# Altium schematic sheet MCU_SCH.SchDoc
size B; SheetNumber: 3; SheetTotal: 9; SPICEModelCacheGSGSOODR: <root> / <DocumentId>GSGSOODR</DocumentId> / <CacheFrame Number="0"> / <Model Name="lmk107b7225_a-tr" Kind="CKT"> / <Text>* LMK107B7225_A-TR     SPICE MODEL  ( General Type ) / *-------------------------------------------------------------------------------------------------------- / * Model Generated by TAIYO YUDEN Corporation (http://www.ty-top.com) / * Version 1.0 / * TAIYO YUDEN Control No. 170508_100817 / * Copyright(c) 2012 TAIYO YUDEN CO.,LTD. All Rights Reserved. / *-------------------------------------------------------------------------------------------------------- / * / * Products Name : Multilayer Ceramic Capacitors / * / * Characteristics : / *     Capacitance : 2.2 uF , Rated Voltage : 10V , TCC : X7R / *     Case Size : 1.6 x 0.8 / 0.063 x 0.031 [mm/inch] , Thickness : 0.8 / 0.031 [mm/inch] / *     (Conditions: Temperature = 25 degC , DC Bias Current/Voltage = 0A / 0V) / * / * Frequency Range : 40Hz - 3GHz / * / * External Node Assignments : / * / *  1  o---| |---o  2 / * / *-------------------------------------------------------------------------------------------------------- / .SubCkt LMK107B7225_A-TR 1 2 / **************************** / C0 1 110 1.6448u / Cm 1 101 0.35593u / C1 101 102 0.58122u / Rc1 101 102 1.399k / C2 102 103 0.16803u / Rc2 102 103 145.45 / C3 103 110 0.093029u / Rc3 103 110 10.174 / C2m 1 301 0.50048u / C21 301 302 1.5848u / Rc21 301 302 3.55k / C22 302 303 1.5193u / Rc22 302 303 3.3641k / C23 303 304 2.179u / Rc23 303 304 2.1549k / C24 304 305 0.86851u / Rc24 304 305 215.54 / C25 305 306 0.87682u / Rc25 305 306 159.72 / C26 306 307 1.7101u / Rc26 306 307 4.7719 / C27 307 308 0.6214u / Rc27 307 308 12.394 / C28 308 309 0.643u / Rc28 308 309 10.101 / C29 309 110 5422p / Rc29 309 110 0.99109 / Rp0 1 110 45.4545454545455Meg / L0 110 120 0.23321n / Lm 120 130 0.16586n / L1 120 121 0.12676n / RL1 121 130 86.335m / L2 120 122 0.61599n / RL2 122 130 0.38949 / L3 120 123 0.67084n / RL3 123 130 0.43251 / CR 120 124 0.12415u / LR 124 125 0.46265n / RR 125 130 72.926m / CL 130 140 1.3749p / LL 130 140 0.23217n / RL 130 140 32.536 / Rs 140 2 6.8187m / **************************** / .ends LMK107B7225_A-TR</Text> / </Model> / </CacheFrame> / </root>
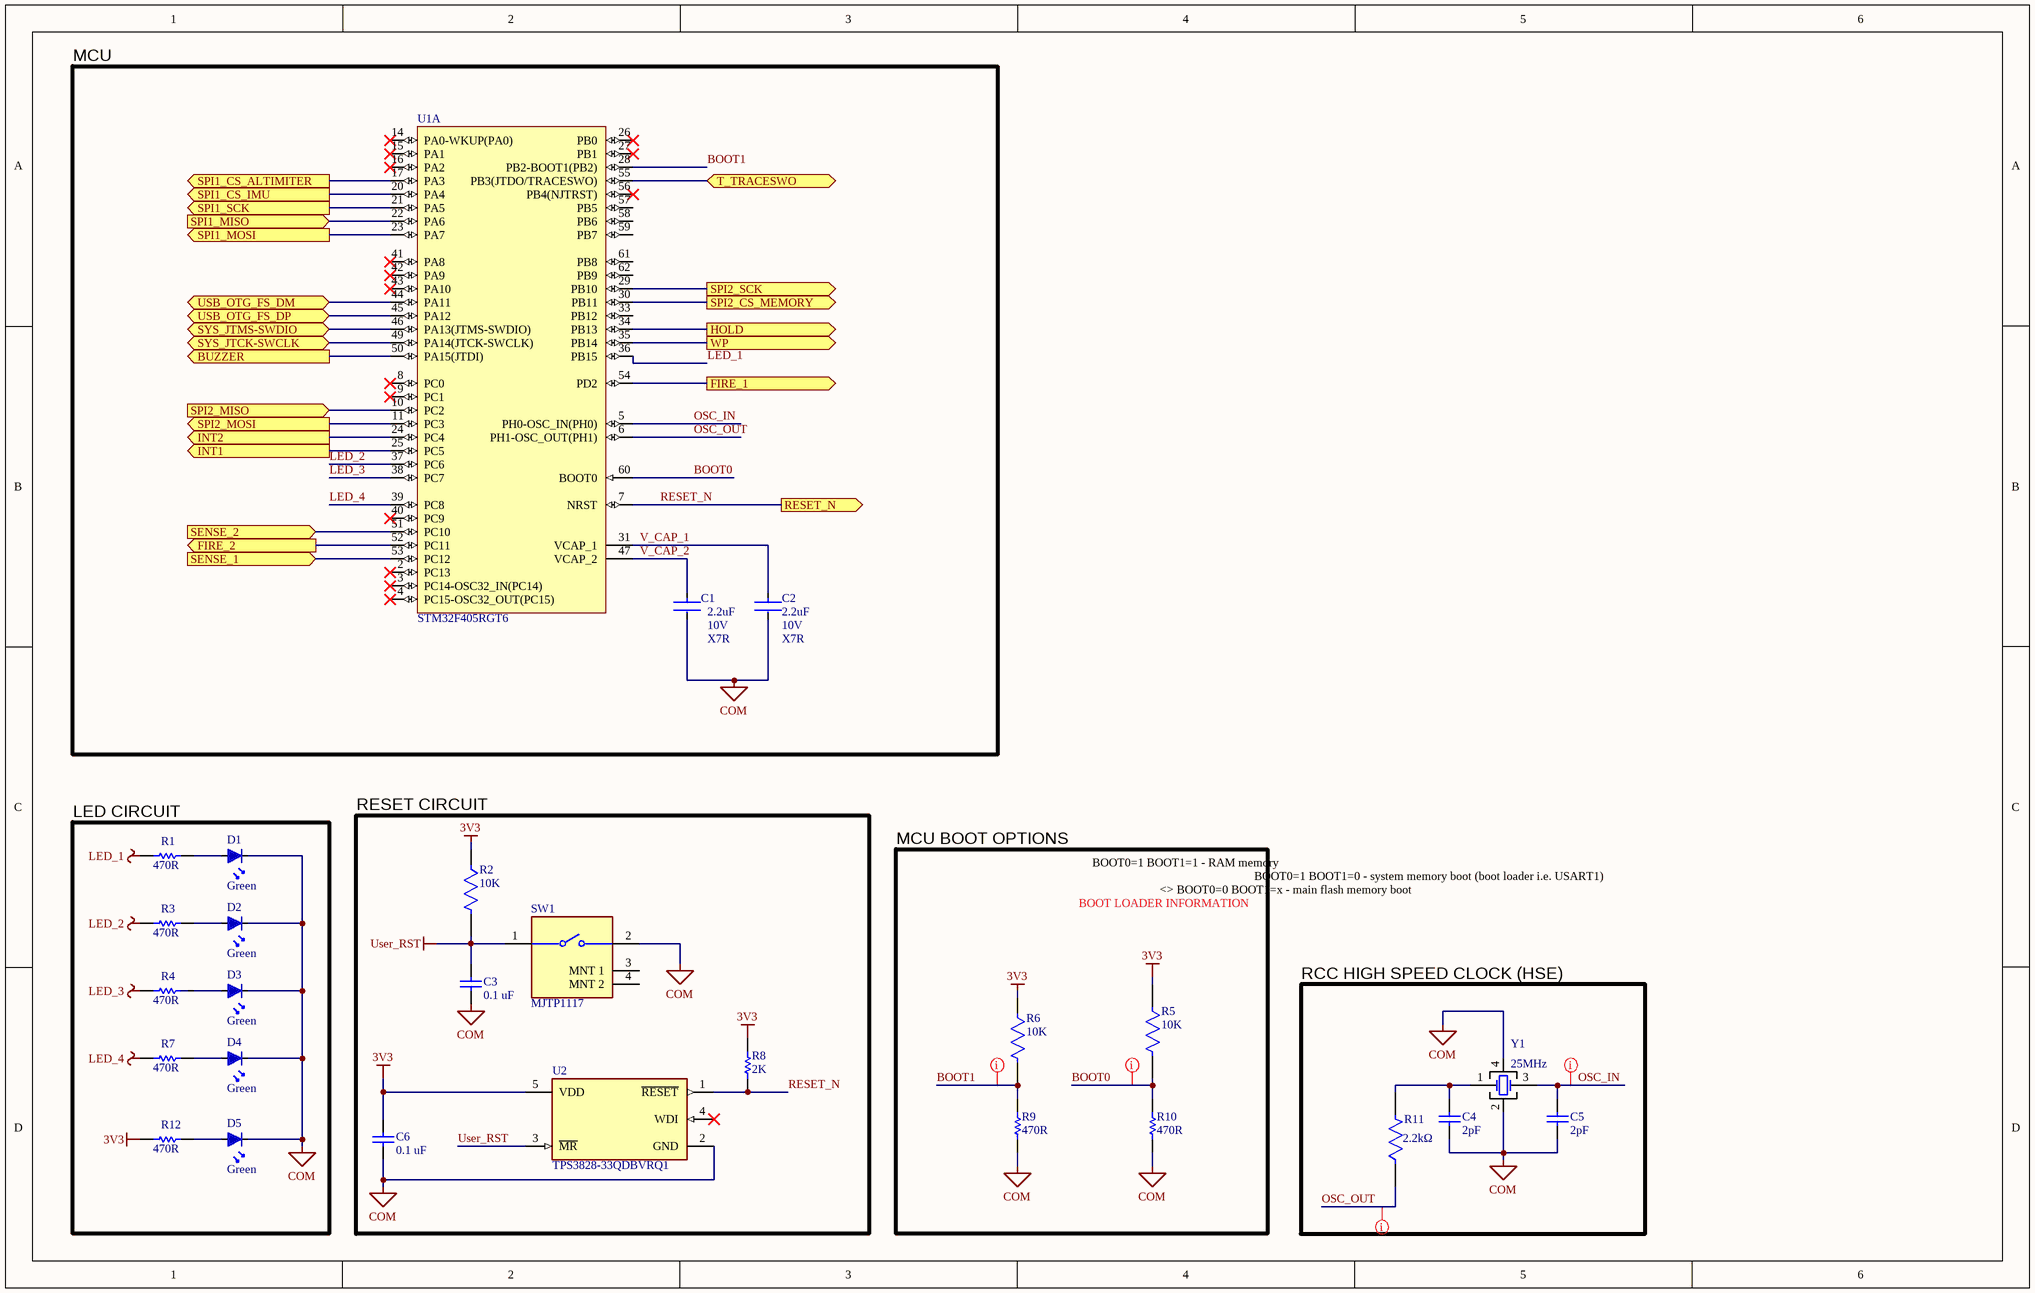
[diagram p0: MCU_SCH.SchDoc]

## Parts
C1  Dielectric: X7R  Voltage Rating: 10V  Capacitance: 2.2uF  [FP-0603-L_1_6_0_1-W_0_8_0-IPC_C]  (hidden comment: LMK107B7225KA-TR)
C2  Dielectric: X7R  Voltage Rating: 10V  Capacitance: 2.2uF  [FP-0603-L_1_6_0_1-W_0_8_0-IPC_C]  (hidden comment: LMK107B7225KA-TR)
C3  0.1 uF  [MURA-0603_H_0.9_M]
C4  2pF  [CAPC1608X92X38LL15T08]
C5  2pF  [CAPC1608X92X38LL15T08]
C6  0.1 uF  [MURA-0603_H_0.9_M]
D1  Color: Green  [D0805]  (hidden comment: SML-LXR85GC-TR)
D2  Color: Green  [D0805]  (hidden comment: SML-LXR85GC-TR)
D3  Color: Green  [D0805]  (hidden comment: SML-LXR85GC-TR)
D4  Color: Green  [D0805]  (hidden comment: SML-LXR85GC-TR)
D5  Color: Green  [D0805]  (hidden comment: SML-LXR85GC-TR)
R1  470R  [RESC1608X55X30NL15T15]
R2  10K  [FP-ERJ3G-IPC_C]
R3  470R  [RESC1608X55X30NL15T15]
R4  470R  [RESC1608X55X30NL15T15]
R5  10K  [FP-ERJ3G-IPC_C]
R6  10K  [FP-ERJ3G-IPC_C]
R7  470R  [RESC1608X55X30NL15T15]
R8  2K  [RESC1608X55X30LL15T15]
R9  470R  [RESC1608X55X30NL15T15]
R10  470R  [RESC1608X55X30NL15T15]
R11  Resistance: 2.2kΩ  [FP-ERJ3G-MFG]  (hidden comment: ERJ-3GEYJ222V)
R12  470R  [RESC1608X55X30NL15T15]
SW1  MJTP1117  [FP-MJTP1117-MFG]
U1  STM32F405RGT6  [STM-LQFP64_M]  (part A of 2)
U2  TPS3828-33QDBVRQ1  [FP-DBV0005A-IPC_C]
Y1  Frequency: 25MHz  [ECS - 4-SMD, No Lead]  (hidden comment: 490-18333-1-ND)

## Blocks framed on the sheet
MCU: C1 C2 U1
LED CIRCUIT: D1-D5 R1 R3 R4 R7 R12
RESET CIRCUIT: C3 C6 R2 R8 SW1 U2
MCU BOOT OPTIONS: R5 R6 R9 R10
RCC HIGH SPEED CLOCK (HSE): C4 C5 R11 Y1

## Ports
BUZZER (out), FIRE_1 (out), FIRE_2 (out), HOLD (out), INT1 (out), INT2 (out), RESET_N (out), SENSE_1 (in), SENSE_2 (in), SPI1_CS_ALTIMITER (out), SPI1_CS_IMU (out), SPI1_MISO (in), SPI1_MOSI (out), SPI1_SCK (out), SPI2_CS_MEMORY (out), SPI2_MISO (in), SPI2_MOSI (out), SPI2_SCK (out), SYS_JTCK-SWCLK (bidir), SYS_JTMS-SWDIO (bidir), T_TRACESWO (bidir), USB_OTG_FS_DM (bidir), USB_OTG_FS_DP (bidir), WP (out)

## Nets
3V3: C6.2 R2.1 R5.1 R6.1 R8.2 R12.1 U2.5(VDD)
COM: C1.2 C2.2 C3.1 C4.2 C5.2 C6.1 D1.K D2.K D3.K D4.K D5.K R9.1 R10.1 SW1.2 U2.2(GND) Y1.2 Y1.4
LED_1: R1.1 U1.36(PB15)
LED_2: R3.1 U1.37(PC6)
LED_3: R4.1 U1.38(PC7)
LED_4: R7.1 U1.39(PC8)
User_RST: C3.2 R2.2 SW1.1 U2.3(~{MR})
BOOT0: R5.2 R10.2 U1.60(BOOT0)
BOOT1: R6.2 R9.2 U1.28(PB2-BOOT1(PB2))
BUZZER: U1.50(PA15(JTDI)) ; port BUZZER
FIRE_1: U1.54(PD2) ; port FIRE_1
FIRE_2: U1.52(PC11) ; port FIRE_2
HOLD: U1.34(PB13) ; port HOLD
INT1: U1.25(PC5) ; port INT1
INT2: U1.24(PC4) ; port INT2
OSC_IN: C5.1 U1.5(PH0-OSC_IN(PH0)) Y1.3(OSC2)
OSC_OUT: R11.1 U1.6(PH1-OSC_OUT(PH1))
RESET_N: R8.1 U1.7(NRST) U2.1(~{RESET}) ; port RESET_N
SENSE_1: U1.53(PC12) ; port SENSE_1
SENSE_2: U1.51(PC10) ; port SENSE_2
SPI1_CS_ALTIMITER: U1.17(PA3) ; port SPI1_CS_ALTIMITER
SPI1_CS_IMU: U1.20(PA4) ; port SPI1_CS_IMU
SPI1_MISO: U1.22(PA6) ; port SPI1_MISO
SPI1_MOSI: U1.23(PA7) ; port SPI1_MOSI
SPI1_SCK: U1.21(PA5) ; port SPI1_SCK
SPI2_CS_MEMORY: U1.30(PB11) ; port SPI2_CS_MEMORY
SPI2_MISO: U1.10(PC2) ; port SPI2_MISO
SPI2_MOSI: U1.11(PC3) ; port SPI2_MOSI
SPI2_SCK: U1.29(PB10) ; port SPI2_SCK
SYS_JTCK-SWCLK: U1.49(PA14(JTCK-SWCLK)) ; port SYS_JTCK-SWCLK
SYS_JTMS-SWDIO: U1.46(PA13(JTMS-SWDIO)) ; port SYS_JTMS-SWDIO
T_TRACESWO: U1.55(PB3(JTDO/TRACESWO)) ; port T_TRACESWO
USB_OTG_FS_DM: U1.44(PA11) ; port USB_OTG_FS_DM
USB_OTG_FS_DP: U1.45(PA12) ; port USB_OTG_FS_DP
V_CAP_1: C2.1 U1.31(VCAP_1)
V_CAP_2: C1.1 U1.47(VCAP_2)
WP: U1.35(PB14) ; port WP
NetC4_1: C4.1 R11.2 Y1.1(OSC1)
NetD1_A: D1.A R1.2
NetD2_A: D2.A R3.2
NetD3_A: D3.A R4.2
NetD4_A: D4.A R7.2
NetD5_A: D5.A R12.2

Not connected (* = marked no-connect by the designer): SW1 3(MNT_1) 4(MNT_2); U1 2(PC13)* 3(PC14-OSC32_IN(PC14))* 4(PC15-OSC32_OUT(PC15))* 8(PC0)* 9(PC1)* 14(PA0-WKUP(PA0))* 15(PA1)* 16(PA2)* 26(PB0)* 27(PB1)* 33(PB12) 40(PC9)* 41(PA8)* 42(PA9)* 43(PA10)* 56(PB4(NJTRST))* 57(PB5) 58(PB6) 59(PB7) 61(PB8) 62(PB9); U2 4(WDI)*

## Layout directives
net class 50_Ohm: BOOT0, BOOT1, OSC_IN, OSC_OUT

## Notes on the sheet
- BOOT LOADER INFORMATION
- BOOT0=1 BOOT1=1 - RAM memory
- <> BOOT0=0 BOOT1=x - main flash memory boot
- BOOT0=1 BOOT1=0 - system memory boot (boot loader i.e. USART1)

## Library data of the parts
C1 = CMP-14477-000474-2: CAP CER 2.2UF 10V X7R 0603; Tolerance: 10%; RoHS Compliant: Yes; Min Operating Temperature: -55°C; Width: 0.031inch; Packaging: Tape and Reel; Termination: Wraparound; Case/Package: 0603; Halogen Free: Halogen Free; Mount: Surface Mount; Thickness: 0.035inch; Length: 0.063inch; Voltage Rating (DC): 10V; Max Operating Temperature: 125°C
C2 = CMP-14477-000474-2: None; Tolerance: 10%; RoHS Compliant: Yes; Min Operating Temperature: -55°C; Width: 0.031inch; Packaging: Tape and Reel; Termination: Wraparound; Case/Package: 0603; Halogen Free: Halogen Free; Mount: Surface Mount; Thickness: 0.035inch; Length: 0.063inch; Voltage Rating (DC): 10V; Max Operating Temperature: 125°C
C3 = CMP-2000-05253-1: CAP, Ceramic, 0.1 uF, 10%, 16 V, 0603, RoHS, Tape and Reel; Manufacturer: Murata; Capacitance - pF: 100000pF; Case Length: 1.6mm; Voltage Rating DC: 16V; Brand: MurataElectronics; Temperature Coefficient / Code: +/-15%; Case Width: 0.8mm; Type: GeneralPurposeMLCC; Capacitance: 0.1uF; Dielectric: X7R; Capacitance - nF: 100nF; Product Category: MultilayerCeramicCapacitorsMLCC-SMD/SMT; Datasheet URL: https://datasheet.ciiva.com/29202/451467-da-01-en-vs-kondensator-0603-29202287.pdf; Termination Style: SMD/SMT; Operating Temperature Range: -55Cto+125C; Case Code - in: 0603; Datasheet Version: Dec-10; Dimensions: 0.8mmWx1.6mmLx0.8mmH; RoHS: Details; Case Code - mm: 1608; Product: GeneralTypeMLCCs; Voltage Rating: 16V; Package / Case: 0603(1608metric); Factory Pack Quantity: 4000; Packaging: Reel; Maximum Operating Temperature: +125C; Manufacturer URL: http://www.murata.com/; Case Height: 0.8mm; Minimum Operating Temperature: -55C; Series: GRM; Tolerance: 10%
C4 C5 = CMP-2006-01521-1: VJ0603D471KXXAJ CAP CER 2PF 50V C0G/NP0 0603; Manufacturer: Vitramon; Part Number: VJ0603D471KXXAJ
C6 = CMP-2000-05253-1: CAP, Ceramic, 0.1 uF, 10%, 16 V, 0603, RoHS, Tape and ReelGRM188R71C104KA01D / Replaced by:  C0603C104K4RAC7081; Manufacturer: Murata; Capacitance - pF: 100000pF; Case Length: 1.6mm; Voltage Rating DC: 16V; Brand: MurataElectronics; Temperature Coefficient / Code: +/-15%; Case Width: 0.8mm; Type: GeneralPurposeMLCC; Capacitance: 0.1uF; Dielectric: X7R; Capacitance - nF: 100nF; Product Category: MultilayerCeramicCapacitorsMLCC-SMD/SMT; Datasheet URL: https://datasheet.ciiva.com/29202/451467-da-01-en-vs-kondensator-0603-29202287.pdf; Termination Style: SMD/SMT; Operating Temperature Range: -55Cto+125C; Case Code - in: 0603; Datasheet Version: Dec-10; Dimensions: 0.8mmWx1.6mmLx0.8mmH; RoHS: Details; Case Code - mm: 1608; Product: GeneralTypeMLCCs; Voltage Rating: 16V; Package / Case: 0603(1608metric); Factory Pack Quantity: 4000; Packaging: Reel; Maximum Operating Temperature: +125C; Manufacturer URL: http://www.murata.com/; Case Height: 0.8mm; Minimum Operating Temperature: -55C; Series: GRM; Tolerance: 10%
D1-D5 = SML-LXR85GC-TR: LED RA 565NM GREEN WTR CLR SMD 0805; Voltage - DC Reverse (Vr) (Max): 5V; Voltage - Forward (Vf) (Typ): 2.2V; Current - Test: 20mA; Viewing Angle: 130°; Millicandela Rating: 12mcd; Lens Style/Size: Rectangle with Domed Top; Lens Color: Colorless; Lens Transparency: Clear; ComponentLink1Description: Datasheet; ComponentLink1URL: http://www.lumex.com/specs/SML-LXR85GC-TR.pdf; ComponentLink2URL: http://media.digikey.com/photos/Lumex%20Photos/Fig%2012%20T052%201546.jpg; ComponentLink2Description: Photo; Wavelength - Peak: 565nm; Supplier 1: Digi-Key; Supplier Part Number 1: 67-1557-1-ND
R1 = CMP-2000-00795-1: 470 Ohm ERJ-3GEYJ471V; Manufacturer: Panasonic; Part Number: ERJ-3GEYJ471V
R2 = CMP-2000-00704-2: RES SMD 10K OHM 5% 1/10W 0603; Temperature Coefficient: 200ppm/°C; Max Power Dissipation: 100mW; Resistance: 10kR; Voltage Rating (DC): 50V; Voltage Rating: 75V; Resistor Type: Thick Film; Tolerance: 5%; Military Standard: Not; Package Quantity: 1; Max Operating Temperature: 155°C; Mount: Surface Mount; Technology: THICK FILM; Case/Package: 0603; Construction: Rectangular; Depth: 0.8mm; Case Code (Imperial): 0603; Weight: 7.1E-05oz; Features: Automotive AEC-Q200; Packaging: Tape and Reel; Width: 0.8mm; Length: 1.6mm; Termination: SMD/SMT; Power Rating: 100mW; Lead Free: Lead Free; Number of Terminations: 2; Height: 0.45mm; RoHS Compliant: Yes; Min Operating Temperature: -55°C; Contact Plating: Tin; REACH SVHC: No SVHC; Resistance Tolerance: 5%; Series: ERJ; Working Voltage: 75V; Case Code (Metric): 1608
R3 R4 R7 R9 R10 R12 = CMP-2000-00795-1: ERJ-3GEYJ471V; Manufacturer: Panasonic; Part Number: ERJ-3GEYJ471V
R5 R6 = CMP-2000-00704-2: RES SMD 10K OHM 5% 1/10W 0603 ERJ-3GEYJ103V; Temperature Coefficient: 200ppm/°C; Max Power Dissipation: 100mW; Resistance: 10kR; Voltage Rating (DC): 50V; Voltage Rating: 75V; Resistor Type: Thick Film; Tolerance: 5%; Military Standard: Not; Package Quantity: 1; Max Operating Temperature: 155°C; Mount: Surface Mount; Technology: THICK FILM; Case/Package: 0603; Construction: Rectangular; Depth: 0.8mm; Case Code (Imperial): 0603; Weight: 7.1E-05oz; Features: Automotive AEC-Q200; Packaging: Tape and Reel; Width: 0.8mm; Length: 1.6mm; Termination: SMD/SMT; Power Rating: 100mW; Lead Free: Lead Free; Number of Terminations: 2; Height: 0.45mm; RoHS Compliant: Yes; Min Operating Temperature: -55°C; Contact Plating: Tin; REACH SVHC: No SVHC; Resistance Tolerance: 5%; Series: ERJ; Working Voltage: 75V; Case Code (Metric): 1608
R8 = CMP-2000-00741-1: ERJ-3GEYJ202V; Manufacturer: Panasonic; Part Number: ERJ-3GEYJ202V
R11 = CMP-2000-00747-2: RES SMD 2.2K OHM 5% 1/10W 0603; Manufacturer: Panasonic; Power Rating: 0.1W; Automotive Grade: Grade 0; Temperature Coefficient: 200ppm/°C; Voltage Rating: 75V; Value: 2.2kΩ; Digikey Description: RES SMD 2.2K OHM 5% 1/10W 0603; Composition: Thick Film; Footprint Url: https://industrial.panasonic.com/cdbs/www-data/pdf/RDA0000/DMA0000COL17.pdf; Temperature: -55°C to +155°C; Temperature Range High: +155°C; Package: ERJ3G; RoHS: TRUE; Lead Free: Yes; Tolerance: 5%; ComponentLink2URL: https://industrial.panasonic.com/cdbs/www-data/pdf/RDA0000/AOA0000C301.pdf; Series: ERJ; Device Class L2: Resistors; Device Class L3: Chip SMD Resistors; Height: 0.55mm; Manufacturer Part Number: ERJ-3GEYJ222V; Temperature Range Low: -55°C; ComponentLink2Description: Datasheet; Octopart: https://octopart.com/erj-3geyj222v-panasonic-55422038; Category: Res; Automotive: Yes; Mouser Description: Thick Film Resistors - SMD 0603 2.2Kohms 5% AEC-Q200; Device Class L1: Passive Components
SW1 = CMP-47024-000001-1: SWITCH TACTILE SPST-NO 0.05A 12V; Manufacturer: Apem Inc.; Contact Resistance: 500mΩ; Contact Current Rating: 50mA; Operating Force: 160gf; Electromechanical Life: 100000Cycles; Mount: Through Hole; RoHS: TRUE; Height: 0.169inch; ComponentLink2URL: https://www.apem.com/int/index.php?controller=attachment&id_attachment=876; Device Class L3: Tactile Switches; Octopart: https://octopart.com/mjtp1117-apem-6499265; Mouser Description: Switch Tactile N.O. SPST Rectangular Button PC Pins 0.05A 12VDC 1.57N Thru-Hole Bulk; Digikey Description: SWITCH TACTILE SPST-NO 0.05A 12V; Category: Switch; Manufacturer Part Number: MJTP1117; Temperature Range High: +70°C; Lead Free: Yes; Device Class L2: Switches; ComponentLink2Description: Datasheet; Temperature Range Low: -20°C; Throw Configuration: SPST-NO; Voltage Rating Dc: 12V; Automotive: No; Package: 0; Temperature: -20°C to +70°C; Device Class L1: Electromechanical
U1 = CMP-0243-00019-3: ARM Cortex-M4 32-bit MCU+FPU, 210 DMIPS, 1024 kB Flash, 192 kB Internal RAM, 51 I/Os, 64-pin LQFP, -40 to 85 degC, Tray; Manufacturer: STMicroelectronics; Supply Voltage(Vcc) min (V): 1.8; Supply Voltage(Vcc) max (V): 3.6; Internal RAM Size (kB): 192; I/Os (High Current): 51; D/A Converter: 2x12-bit; FLASH Size (Prog) (kB): 1024; Operating Frequency(F) (Processor speed) (MHz): 168; ComponentLink2Description: Datasheet; PackageVersion: Rev. 4, 06/2013; DatasheetVersion: Rev. 4; Core: ARM Cortex-M4; ComponentLink2URL: http://www.st.com/st-web-ui/static/active/en/resource/technical/document/datasheet/DM00037051.pdf; PackageReference: LQFP64; Packing: Tray; ComponentLink1Description: Manufacturer URL; ComponentLink3URL: http://www.st.com/st-web-ui/static/active/en/resource/technical/document/datasheet/DM00037051.pdf; ComponentLink3Description: Package Specification; Mounting Technology: Surface Mount; ComponentLink1URL: http://www.st.com/web/en/home.html; PackageDescription: 64-Pin Low Profile Quad Flat Package, 10 x 10 mm Body, 0.5 mm Pitch; PartNumber: STM32F405RGT6
U2 = CMP-04919-000035-1: IC SUPERVISOR 1 CHANNEL SOT23-5; Supply Current: 25uA; Max Supply Voltage: 5.5V; Power Dissipation: 437mW; Quiescent Current: 15uA; Reset: Active Low; Number of Elements: 1; Undervoltage Threshold: 2.93V; Max Reset Threshold Voltage: 3V; Min Supply Voltage: 1.1V; Watchdog Timer: Yes; Min Reset Threshold Voltage: 2.84V; Reset Timeout: 120ms; Packaging: Tape and Reel; Type: Simple Reset/Power-On Reset; Series: -; Max Operating Temperature: 125°C; Case/Package: SOT-23-5; REACH SVHC: No SVHC; Nominal Supply Current: 25uA; RoHS Compliant: Yes; Package Quantity: 1; Max Supply Current: 25uA; Mount: Surface Mount; Min Operating Temperature: -40°C; Threshold Voltage: 2.93V; Radiation Hardening: No; Number of Voltages Monitored: 1; Number of Pins: 5; Max Power Dissipation: 437mW; Operating Supply Current: 15uA; Overvoltage Threshold: 3V; Lead Free: Lead Free
Y1 = XRCGB25M000F0L00R0: CRYSTAL 25.0000MHZ 6PF SMD; Frequency Stability: ±50ppm; Load Capacitance: 8pF; ESR (Equivalent Series Resistance): 50 Ohm; Operating Temperature: -10°C ~ 70°C; Type: MHz Crystal; Frequency Tolerance: ±50ppm; Series: NX5032GA; Supplier 1: Digi-Key